# Altium project Atlas-Pi.PrjPCB
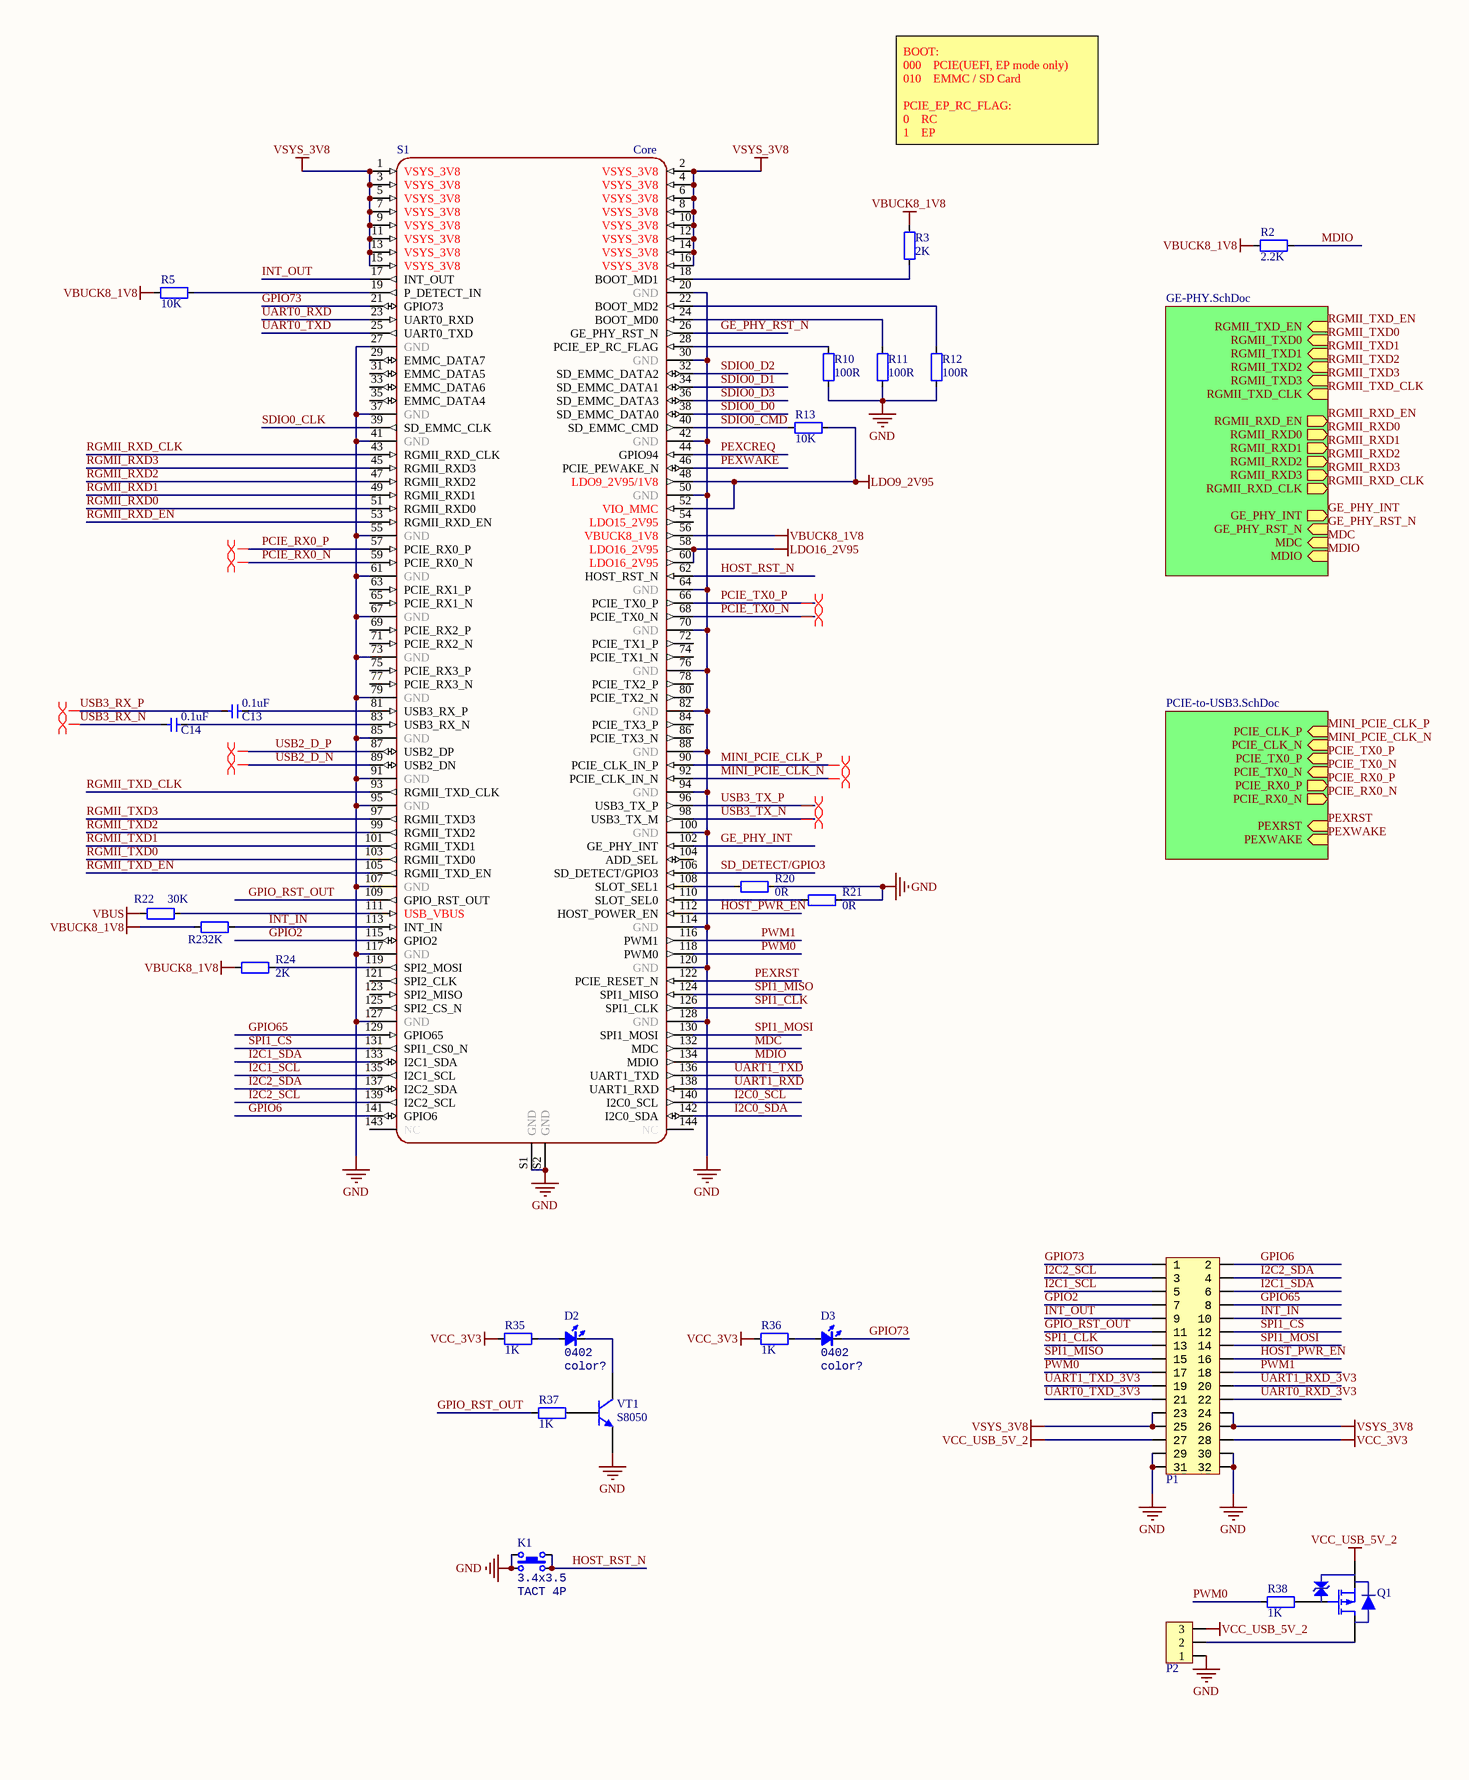
[diagram p0: Main.SchDoc, left]
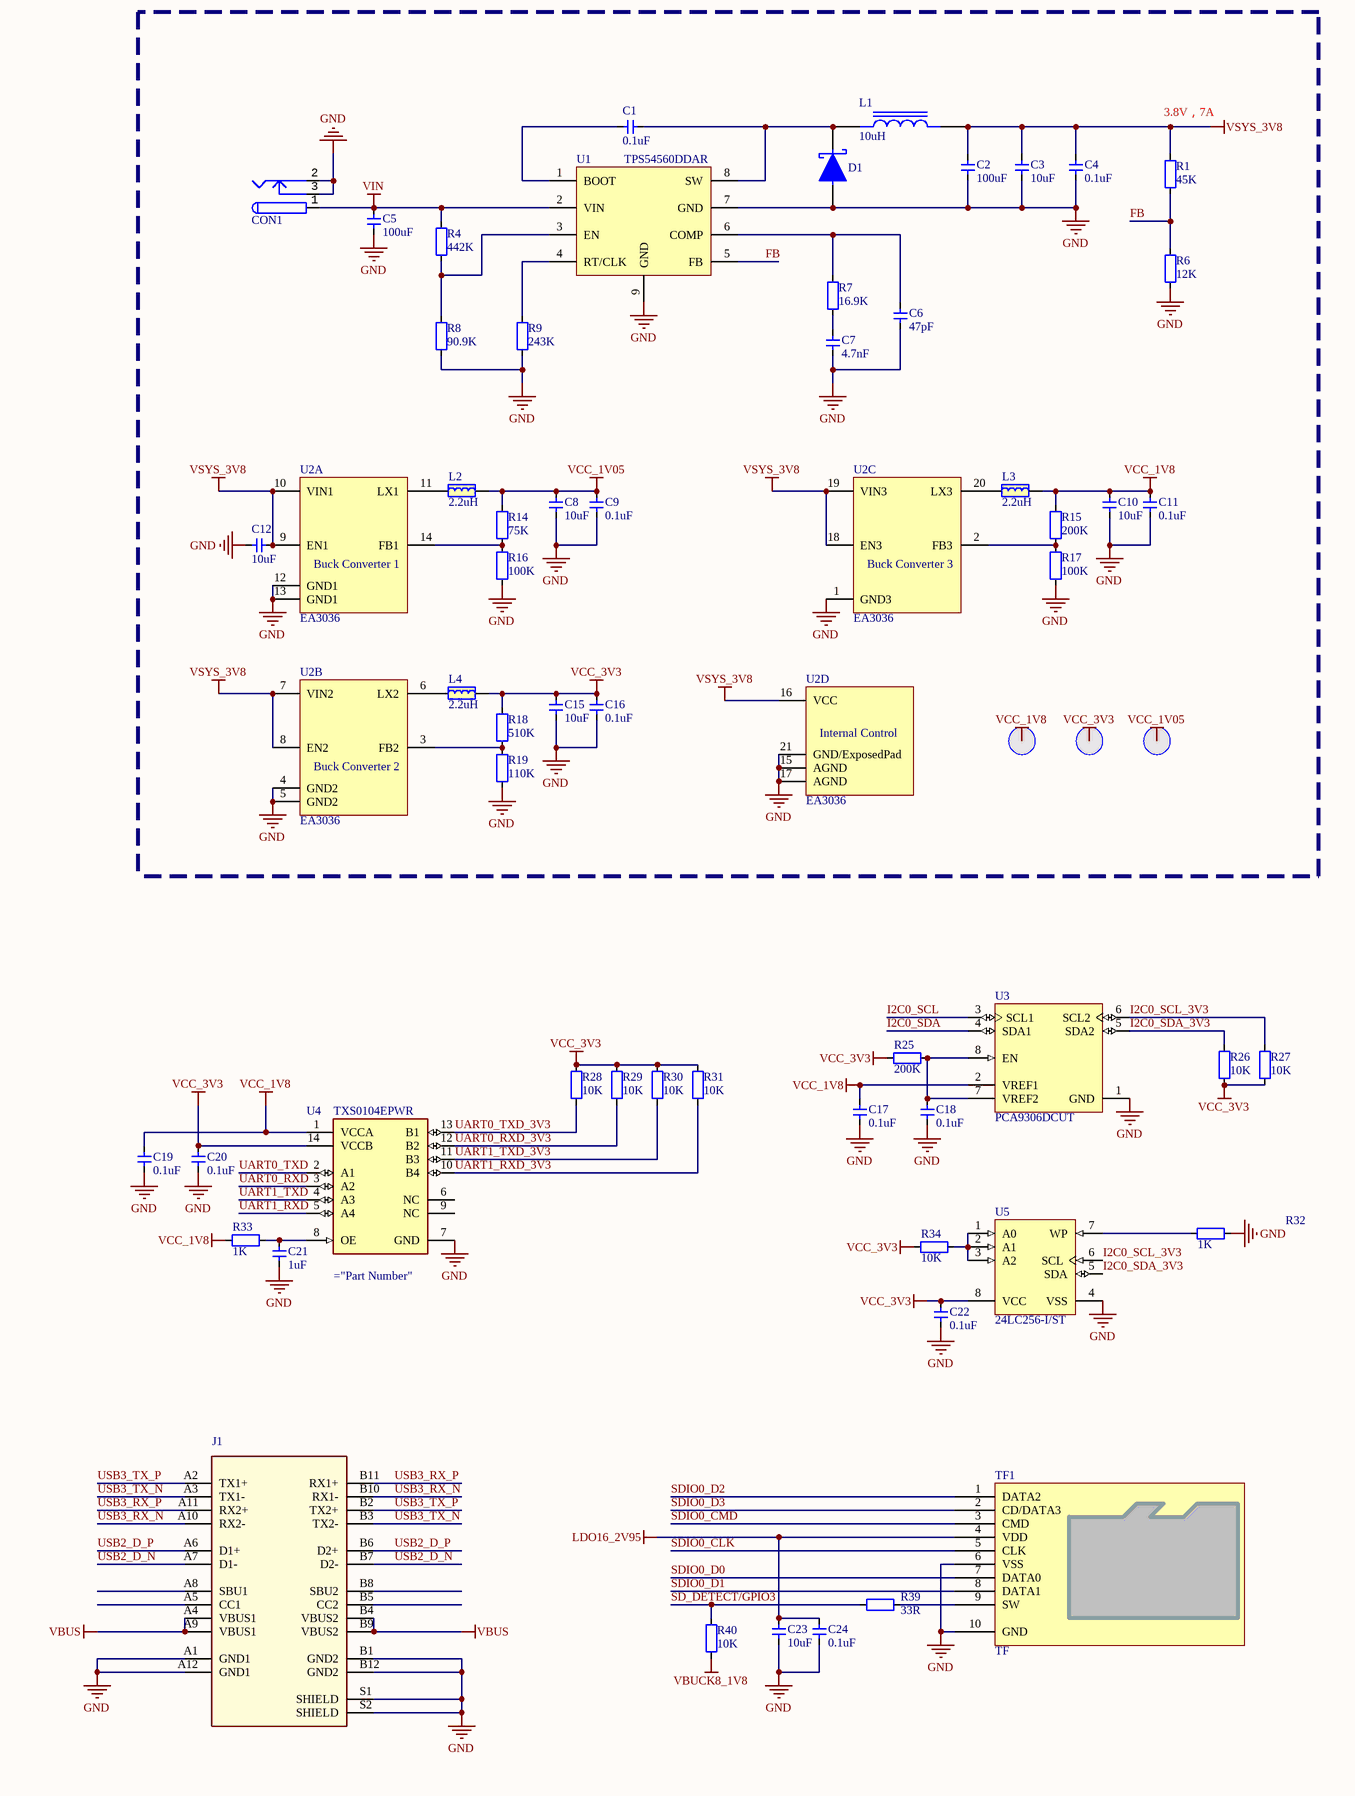
[diagram p1: Main.SchDoc, right]
3 sheets, 216 parts. Net scope: hierarchical (ports join the sheet entries above them; power ports are global).
Board file: Atlas-Pi.PcbDoc
Sheets:
  Main.SchDoc
    GE-PHY = GE-PHY.SchDoc
    PCIE-to-USB3 = PCIE-to-USB3.SchDoc

## Sheet Main.SchDoc
size A2; SheetNumber: 1; SheetTotal: 1

### Parts
C1  0.1uF  [CAP_0402]
C2  100uF  [1206-CAP]
C3  10uF  [CAP_0402]
C4  0.1uF  [CAP_0402]
C5  100uF  [1206-CAP]
C6  47pF  [CAP_0402]
C7  4.7nF  [CAP_0402]
C8  10uF  [CAP_0402]
C9  0.1uF  [CAP_0402]
C10  10uF  [CAP_0402]
C11  0.1uF  [CAP_0402]
C12  10uF  [CAP_0402]
C13  0.1uF  [CAP_0402]
C14  0.1uF  [CAP_0402]
C15  10uF  [CAP_0402]
C16  0.1uF  [CAP_0402]
C17  0.1uF  [CAP_0402]
C18  0.1uF  [CAP_0402]
C19  0.1uF  [CAP_0402]
C20  0.1uF  [CAP_0402]
C21  1uF  [CAP_0402]
C22  0.1uF  [CAP_0402]
C23  10uF  [CAP_0402]
C24  0.1uF  [CAP_0402]
CON1  PowerJack_2.5  [KLD_0202]  (value not drawn)
D1  B560C-13-F  [DO-214AB-SMC]  (value not drawn)
D2  Type: 0402  [LED_0402_ORANGE]  (hidden comment: color?)
D3  Type: 0402  [LED_0402_GREEN]  (hidden comment: color?)
J1  USB-TYPE-C-TE  [USB TYPE C TE]  (value not drawn)
K1  value 3.4x3.5  [ButtonTACT_3.5*3.55_90]  (hidden comment: TACT 4P)
L1  10uH  [IND_1040]
L2  2.2uH  [2520-L]
L3  2.2uH  [2520-L]
L4  2.2uH  [2520-L]
P1  HDR2x16_2.54  [HDR2X16_2.54_180]  (value not drawn)
P2  HDR1x3_1.25  [接插件 3P]  (value not drawn)
Q1  AO3415A  [SOT23-3]  (value not drawn)
R1  45K  [RES_0402]
R2  2.2K  [RES_0402]
R3  2K  [RES_0402]
R4  442K  [RES_0402]
R5  10K  [RES_0402]
R6  12K  [RES_0402]
R7  16.9K  [RES_0402]
R8  90.9K  [RES_0402]
R9  243K  [RES_0402]
R10  100R  [RES_0402]
R11  100R  [RES_0402]
R12  100R  [RES_0402]
R13  10K  [RES_0402]
R14  75K  [RES_0402]
R15  200K  [RES_0402]
R16  100K  [RES_0402]
R17  100K  [RES_0402]
R18  510K  [RES_0402]
R19  110K  [RES_0402]
R20  0R  [RES_0402]
R21  0R  [RES_0402]
R22  30K  [RES_0402]
R23  2K  [RES_0402]
R24  2K  [RES_0402]
R25  200K  [RES_0402]
R26  10K  [RES_0402]
R27  10K  [RES_0402]
R28  10K  [RES_0402]
R29  10K  [RES_0402]
R30  10K  [RES_0402]
R31  10K  [RES_0402]
R32  1K  [RES_0402]
R33  1K  [RES_0402]
R34  10K  [RES_0402]
R35  1K  [RES_0402]
R36  1K  [RES_0402]
R37  1K  [RES_0402]
R38  1K  [RES_0402]
R39  33R  [RES_0402]
R40  10K  [RES_0402]
S1  Core  [ATLAS-200]
T1  测试点  [TEST_PT]  (value not drawn)
T2  测试点  [TEST_PT]  (value not drawn)
T3  测试点  [TEST_PT]  (value not drawn)
TF1  TF  [TF-SOCKET]
U1  TPS54560DDAR  [SO-8-PAD]
U2  EA3036  [QFN-20]  (parts A,B,C,D of 4)
U3  PCA9306DCUT  [VSSOP-8]
U4  TXS0104EPWR  [R-PDSO-G14]
U5  24LC256-I/ST  [TSSOP-8]
VT1  S8050  [SMT_TRIODE_NPN]

### Sub-sheets
GE-PHY = GE-PHY.SchDoc: RGMII_RXD_EN (out), RGMII_RXD0 (out), RGMII_TXD3 (in), RGMII_RXD3 (out), RGMII_TXD0 (in), RGMII_RXD1 (out), RGMII_RXD2 (out), RGMII_TXD_EN (in), GE_PHY_RST_N (in), RGMII_TXD_CLK (in), RGMII_RXD_CLK (out), RGMII_TXD2 (in), RGMII_TXD1 (in), MDIO (in), MDC (in), GE_PHY_INT (out)
PCIE-to-USB3 = PCIE-to-USB3.SchDoc: PEXWAKE (in), PEXRST (in), PCIE_CLK_N (in), PCIE_RX0_N (out), PCIE_TX0_P (in), PCIE_TX0_N (in), PCIE_RX0_P (out), PCIE_CLK_P (in)

### Nets
GND: C2.1 C3.2 C4.2 C5.1 C6.1 C7.1 C8.2 C9.2 C10.2 C11.2 C12.1 C15.2 C16.2 C17.1 C18.1 C19.1 C20.1 C21.1 C22.1 C23.2 C24.2 CON1.2 CON1.3 D1.2(A) J1.A1(GND1) J1.A12(GND1) J1.B1(GND2) J1.B12(GND2) J1.S1(SHIELD) J1.S2(SHIELD) K1.1 K1.3 P1.29 P1.30 P1.31 P1.32 P2.1 R6.1 R8.1 R9.1 R10.2 R11.2 R12.2 R16.1 R17.1 R19.1 R20.1 R21.1 R32.1 S1.20(GND) S1.27(GND) S1.30(GND) S1.37(GND) S1.41(GND) S1.42(GND) S1.50(GND) S1.55(GND) S1.61(GND) S1.64(GND) S1.67(GND) S1.70(GND) S1.73(GND) S1.76(GND) S1.79(GND) S1.82(GND) S1.85(GND) S1.88(GND) S1.91(GND) S1.94(GND) S1.95(GND) S1.100(GND) S1.107(GND) S1.114(GND) S1.117(GND) S1.120(GND) S1.127(GND) S1.128(GND) S1.S1(GND) S1.S2(GND) TF1.6(VSS) TF1.10(GND) U1.7(GND) U1.9(GND) U2.1(GND3) U2.4(GND2) U2.5(GND2) U2.12(GND1) U2.13(GND1) U2.15(AGND) U2.17(AGND) U2.21(GND/ExposedPad) U3.1(GND) U4.7(GND) U5.4(VSS) VT1.2(E)
LDO9_2V95: R13.2 S1.48(LDO9_2V95/1V8) S1.52(VIO_MMC)
LDO16_2V95: C23.1 C24.1 S1.58(LDO16_2V95) S1.60(LDO16_2V95) TF1.4(VDD)
VBUCK8_1V8: R2.1 R3.1 R5.1 R23.2 R24.2 R40.1 S1.56(VBUCK8_1V8)
VBUS: J1.A4(VBUS1) J1.A9(VBUS1) J1.B4(VBUS2) J1.B9(VBUS2) R22.2
VCC_1V05: C8.1 C9.1 L2.2 R14.2 T3.0
VCC_1V8: C10.1 C11.1 C17.2 C19.2 L3.2 R15.2 R33.2 T1.0 U3.2(VREF1) U4.1(VCCA)
VCC_3V3: C15.1 C16.1 C20.2 C22.2 L4.2 P1.28 R18.2 R25.1 R26.1 R27.1 R28.1 R29.1 R30.1 R31.1 R34.2 R35.1 R36.1 T2.0 U4.14(VCCB) U5.8(VCC)
VCC_USB_5V_2: P1.27 P2.3 Q1.2(S)
VIN: C5.2 CON1.1 R4.2 U1.2(VIN)
VSYS_3V8: C2.2 C3.1 C4.1 C12.2 L1.2 P1.23 P1.24 P1.25 P1.26 R1.2 S1.1(VSYS_3V8) S1.2(VSYS_3V8) S1.3(VSYS_3V8) S1.4(VSYS_3V8) S1.5(VSYS_3V8) S1.6(VSYS_3V8) S1.7(VSYS_3V8) S1.8(VSYS_3V8) S1.9(VSYS_3V8) S1.10(VSYS_3V8) S1.11(VSYS_3V8) S1.12(VSYS_3V8) S1.13(VSYS_3V8) S1.14(VSYS_3V8) S1.15(VSYS_3V8) S1.16(VSYS_3V8) U2.7(VIN2) U2.8(EN2) U2.9(EN1) U2.10(VIN1) U2.16(VCC) U2.18(EN3) U2.19(VIN3)
FB: R1.1 R6.2 U1.5(FB)
GE_PHY_INT: S1.102(GE_PHY_INT) ; sheet GE-PHY/GE_PHY_INT
GE_PHY_RST_N: S1.26(GE_PHY_RST_N) ; sheet GE-PHY/GE_PHY_RST_N
GPIO2: P1.7 S1.115(GPIO2)
GPIO6: P1.2 S1.141(GPIO6)
GPIO65: P1.8 S1.129(GPIO65)
GPIO73: D3.2(K) P1.1 S1.21(GPIO73)
GPIO_RST_OUT: P1.11 R37.1 S1.109(GPIO_RST_OUT)
HOST_PWR_EN: P1.16 S1.112(HOST_POWER_EN)
HOST_RST_N: K1.2 K1.4 S1.62(HOST_RST_N)
I2C0_SCL: S1.140(I2C0_SCL) U3.3(SCL1)
I2C0_SCL_3V3: R27.2 U3.6(SCL2) U5.6(SCL)
I2C0_SDA: S1.142(I2C0_SDA) U3.4(SDA1)
I2C0_SDA_3V3: R26.2 U3.5(SDA2) U5.5(SDA)
I2C1_SCL: P1.5 S1.135(I2C1_SCL)
I2C1_SDA: P1.6 S1.133(I2C1_SDA)
I2C2_SCL: P1.3 S1.139(I2C2_SCL)
I2C2_SDA: P1.4 S1.137(I2C2_SDA)
INT_IN: P1.10 R23.1 S1.113(INT_IN)
INT_OUT: P1.9 S1.17(INT_OUT)
MDC: S1.132(MDC) ; sheet GE-PHY/MDC
MDIO: R2.2 S1.134(MDIO) ; sheet GE-PHY/MDIO
MINI_PCIE_CLK_N: S1.92(PCIE_CLK_IN_N) ; sheet PCIE-to-USB3/PCIE_CLK_N
MINI_PCIE_CLK_P: S1.90(PCIE_CLK_IN_P) ; sheet PCIE-to-USB3/PCIE_CLK_P
PCIE_RX0_N: S1.59(PCIE_RX0_N) ; sheet PCIE-to-USB3/PCIE_RX0_N
PCIE_RX0_P: S1.57(PCIE_RX0_P) ; sheet PCIE-to-USB3/PCIE_RX0_P
PCIE_TX0_N: S1.68(PCIE_TX0_N) ; sheet PCIE-to-USB3/PCIE_TX0_N
PCIE_TX0_P: S1.66(PCIE_TX0_P) ; sheet PCIE-to-USB3/PCIE_TX0_P
PEXCREQ: S1.44(GPIO94)
PEXRST: S1.122(PCIE_RESET_N) ; sheet PCIE-to-USB3/PEXRST
PEXWAKE: S1.46(PCIE_PEWAKE_N) ; sheet PCIE-to-USB3/PEXWAKE
PWM0: P1.17 R38.1 S1.118(PWM0)
PWM1: P1.18 S1.116(PWM1)
RGMII_RXD0: S1.51(RGMII_RXD0) ; sheet GE-PHY/RGMII_RXD0
RGMII_RXD1: S1.49(RGMII_RXD1) ; sheet GE-PHY/RGMII_RXD1
RGMII_RXD2: S1.47(RGMII_RXD2) ; sheet GE-PHY/RGMII_RXD2
RGMII_RXD3: S1.45(RGMII_RXD3) ; sheet GE-PHY/RGMII_RXD3
RGMII_RXD_CLK: S1.43(RGMII_RXD_CLK) ; sheet GE-PHY/RGMII_RXD_CLK
RGMII_RXD_EN: S1.53(RGMII_RXD_EN) ; sheet GE-PHY/RGMII_RXD_EN
RGMII_TXD0: S1.103(RGMII_TXD0) ; sheet GE-PHY/RGMII_TXD0
RGMII_TXD1: S1.101(RGMII_TXD1) ; sheet GE-PHY/RGMII_TXD1
RGMII_TXD2: S1.99(RGMII_TXD2) ; sheet GE-PHY/RGMII_TXD2
RGMII_TXD3: S1.97(RGMII_TXD3) ; sheet GE-PHY/RGMII_TXD3
RGMII_TXD_CLK: S1.93(RGMII_TXD_CLK) ; sheet GE-PHY/RGMII_TXD_CLK
RGMII_TXD_EN: S1.105(RGMII_TXD_EN) ; sheet GE-PHY/RGMII_TXD_EN
SD_DETECT/GPIO3: R39.2 R40.2 S1.106(SD_DETECT/GPIO3)
SDIO0_CLK: S1.39(SD_EMMC_CLK) TF1.5(CLK)
SDIO0_CMD: R13.1 S1.40(SD_EMMC_CMD) TF1.3(CMD)
SDIO0_D0: S1.38(SD_EMMC_DATA0) TF1.7(DATA0)
SDIO0_D1: S1.34(SD_EMMC_DATA1) TF1.8(DATA1)
SDIO0_D2: S1.32(SD_EMMC_DATA2) TF1.1(DATA2)
SDIO0_D3: S1.36(SD_EMMC_DATA3) TF1.2(CD/DATA3)
SPI1_CLK: P1.13 S1.126(SPI1_CLK)
SPI1_CS: P1.12 S1.131(SPI1_CS0_N)
SPI1_MISO: P1.15 S1.124(SPI1_MISO)
SPI1_MOSI: P1.14 S1.130(SPI1_MOSI)
UART0_RXD: S1.23(UART0_RXD) U4.3(A2)
UART0_RXD_3V3: P1.22 R29.2 U4.12(B2)
UART0_TXD: S1.25(UART0_TXD) U4.2(A1)
UART0_TXD_3V3: P1.21 R28.2 U4.13(B1)
UART1_RXD: S1.138(UART1_RXD) U4.5(A4)
UART1_RXD_3V3: P1.20 R31.2 U4.10(B4)
UART1_TXD: S1.136(UART1_TXD) U4.4(A3)
UART1_TXD_3V3: P1.19 R30.2 U4.11(B3)
USB2_D_N: J1.A7(D1-) J1.B7(D2-) S1.89(USB2_DN)
USB2_D_P: J1.A6(D1+) J1.B6(D2+) S1.87(USB2_DP)
USB3_RX_N: C14.2 J1.A10(RX2-) J1.B10(RX1-)
USB3_RX_P: C13.2 J1.A11(RX2+) J1.B11(RX1+)
USB3_TX_N: J1.A3(TX1-) J1.B3(TX2-) S1.98(USB3_TX_M)
USB3_TX_P: J1.A2(TX1+) J1.B2(TX2+) S1.96(USB3_TX_P)
NetC1_1: C1.1 D1.1(C) L1.1 U1.8(SW)
NetC1_2: C1.2 U1.1(BOOT)
NetC6_2: C6.2 R7.2 U1.6(COMP)
NetC7_2: C7.2 R7.1
NetC13_1: C13.1 S1.81(USB3_RX_P)
NetC14_1: C14.1 S1.83(USB3_RX_N)
NetC18_2: C18.2 R25.2 U3.7(VREF2) U3.8(EN)
NetC21_2: C21.2 R33.1 U4.8(OE)
NetD2_1: D2.1(A) R35.2
NetD2_2: D2.2(K) VT1.3(C)
NetD3_1: D3.1(A) R36.2
NetL2_1: L2.1 U2.11(LX1)
NetL3_1: L3.1 U2.20(LX3)
NetL4_1: L4.1 U2.6(LX2)
NetP2_2: P2.2 Q1.3(D)
NetQ1_1: Q1.1(G) R38.2
NetR3_2: R3.2 S1.18(BOOT_MD1)
NetR4_1: R4.1 R8.2 U1.3(EN)
NetR5_2: R5.2 S1.19(P_DETECT_IN)
NetR9_2: R9.2 U1.4(RT/CLK)
NetR10_1: R10.1 S1.28(PCIE_EP_RC_FLAG)
NetR11_1: R11.1 S1.24(BOOT_MD0)
NetR12_1: R12.1 S1.22(BOOT_MD2)
NetR14_1: R14.1 R16.2 U2.14(FB1)
NetR15_1: R15.1 R17.2 U2.2(FB3)
NetR18_1: R18.1 R19.2 U2.3(FB2)
NetR20_2: R20.2 S1.108(SLOT_SEL1)
NetR21_2: R21.2 S1.110(SLOT_SEL0)
NetR22_1: R22.1 S1.111(USB_VBUS)
NetR24_1: R24.1 S1.119(SPI2_MOSI)
NetR32_2: R32.2 U5.7(WP)
NetR34_1: R34.1 U5.1(A0) U5.2(A1) U5.3(A2)
NetR37_2: R37.2 VT1.1(B)
NetR39_1: R39.1 TF1.9(SW)

Not connected (* = marked no-connect by the designer): J1 A5(CC1) A8(SBU1) B5(CC2) B8(SBU2); S1 29(EMMC_DATA7) 31(EMMC_DATA5) 33(EMMC_DATA6) 35(EMMC_DATA4) 54(LDO15_2V95) 63(PCIE_RX1_P) 65(PCIE_RX1_N) 69(PCIE_RX2_P) 71(PCIE_RX2_N) 72(PCIE_TX1_P) 74(PCIE_TX1_N) 75(PCIE_RX3_P) 77(PCIE_RX3_N) 78(PCIE_TX2_P) 80(PCIE_TX2_N) 84(PCIE_TX3_P) 86(PCIE_TX3_N) 104(ADD_SEL) 121(SPI2_CLK) 123(SPI2_MISO) 125(SPI2_CS_N) 143(NC) 144(NC); U4 6(NC) 9(NC)

### Layout directives
differential pair: MINI_PCIE_CLK_N, MINI_PCIE_CLK_P, PCIE_RX0_N, PCIE_RX0_P, PCIE_TX0_N, PCIE_TX0_P, USB2_D_N, USB2_D_P, USB3_RX_N, USB3_RX_P, USB3_TX_N, USB3_TX_P

### Notes on the sheet
- BOOT:
  000    PCIE(UEFI, EP mode only)
  010    EMMC / SD Card
  PCIE_EP_RC_FLAG:
  0    RC
  1    EP
- (near R1) 3.8V，7A
- (in symbol EA3036, part A) Buck Converter 1
- (in symbol EA3036, part B) Buck Converter 2
- (in symbol EA3036, part C) Buck Converter 3
- (in symbol EA3036, part D) Internal Control

### Library data of the parts
C1 C3 C4 C6-C24 = 电容-0402: Capacitor; Value: 0.1u
C2 C5 = 电容-1206: Capacitor; Value: 0.1u
CON1 = PowerJack_2.5: DC Power Jack
D2 D3 = LED_0402: LED; Value: color?
J1 = USB-TYPE-C-TE: SPLASH PROOF USB TYPE C REC, DUAL SMT; MP: 2295018-2; Number_of_Positions: 24; MF: TE Connectivity; Product_Type: Connector; Centerline_Pitch: .5 mm[.019 in]; EU_RoHS_Compliance: Compliant; Availability: Good; Package: None; Link: http://www.te.com/usa-en/product-2295018-2.html; Price: 1.84 USD; SnapEDA_Link: https://www.snapeda.com/parts/2295018-2/TE%20Connectivity%20AMP%20Connectors/view-part/?ref=snap; Value: *
K1 = ButtonTACT: Button; type: TACT 4P
L1 = 电感-1040: Fixed Inductors 4.7uH 30% SMD 1240; MF: Bourns; MP: SRR1240-4R7Y; Price: None; SnapEDA_Link: https://www.snapeda.com/parts/SRR1240-4R7Y/Bourns/view-part/1646614/?ref=snap; Check_prices: https://www.snapeda.com/parts/SRR1240-4R7Y/Bourns/view-part/1646614/?ref=eda; Availability: Bad; Package: None; Value: *
L2-L4 = 电感-2520: 磁珠
P1 = HDR2x16_2.54: Header
P2 = HDR1x3_1.25: Header
Q1 = AO3415A: MOSFET; Published: 8-Jun-2000; LatestRevisionDate: 17-Jul-2002; LatestRevisionNote: Re-released for DXP Platform.; PackageVersion: 1995/1996; PackageReference: E3; Publisher: Altium Limited; PackageDescription: TO, Flat Index; 3 In-Line, Axial Leads; Body Dia. 4.6mm; Lead Dia. 0.5 mm (max)
R1-R40 = 电阻-0402: Resistor; Value: 22R
S1 = Atlas-200: Atlas-A200 AI-SOM
TF1 = TF卡座: 8脚自弹
U1 = TPS54560DDAR: DC-DC Convter
U2 = EA3036: EA3036 is a 3CH power management IC for applications powered by one Li-Ion battery or a DC 5V adapter.
U3 = PCA9306DCUT: Dual Bi-Directional I2C-Bus and SMBus Voltage Level-Translator, 0 to 5.5 V, -40 to 85 degC, 8-pin US8 (DCU), Green (RoHS & no Sb/Br); Manufacturer: Texas Instruments; SubFamily: I2C Special Function; Function: Voltage Translator; fSCLK(Max)(MHz): 400; Open Drain I/O Type: Yes; No. of Outputs: 2; Vcc range(V): 0 to 5.5; Rating: Catalog; tpd max(ns): 1.5; Eco-Plan: Green (RoHS & no Sb/Br); PartNumber: PCA9306DCUT; ComponentLink1Description: Datasheet; ComponentLink2Description: Package Specification; DatasheetVersion: SCPS113J; ComponentLink1URL: http://www.ti.com/general/docs/lit/getliterature.tsp?genericPartNumber=PCA9306&fileType=pdf; Code_JEDEC: MO-187-CA; ComponentLink2URL: http://www.ti.com/litv/pdf/mpds050d; Enable Pin: Yes; PackageReference: DCU8; 5V Tolerant I/O: Yes; On-Chip Power-on-Reset: No; PackageVersion: revF, Jul-2005; PackageDescription: 8-Pin Thin Shrink Small Outline Package 0.5 mm Pitch; Mounting Technology: Surface Mount; Max Frequency(kHz): 400
U5 = 24LC256-I/ST: 256Kbit, 400kHz, 2.5V, I2C Serial EEPROM, 8-Pin TSSOP, Industrial Temperature; Code_JEDEC: MO-153; PackageVersion: revBB, Aug-2009; PackageReference: TSSOP-ST8; PackageDescription: 8-Lead Plastic Thin Shrink Small Outline (ST) - 4.4mm Body [TSSOP]; DatasheetVersion: revP, Oct-2007; PartNumber: 24LC256-I/ST
VT1 = SMT_TRIODE_NPN: Surface mount NPN transistor, package SOT-23

## Sheet GE-PHY.SchDoc
size A4
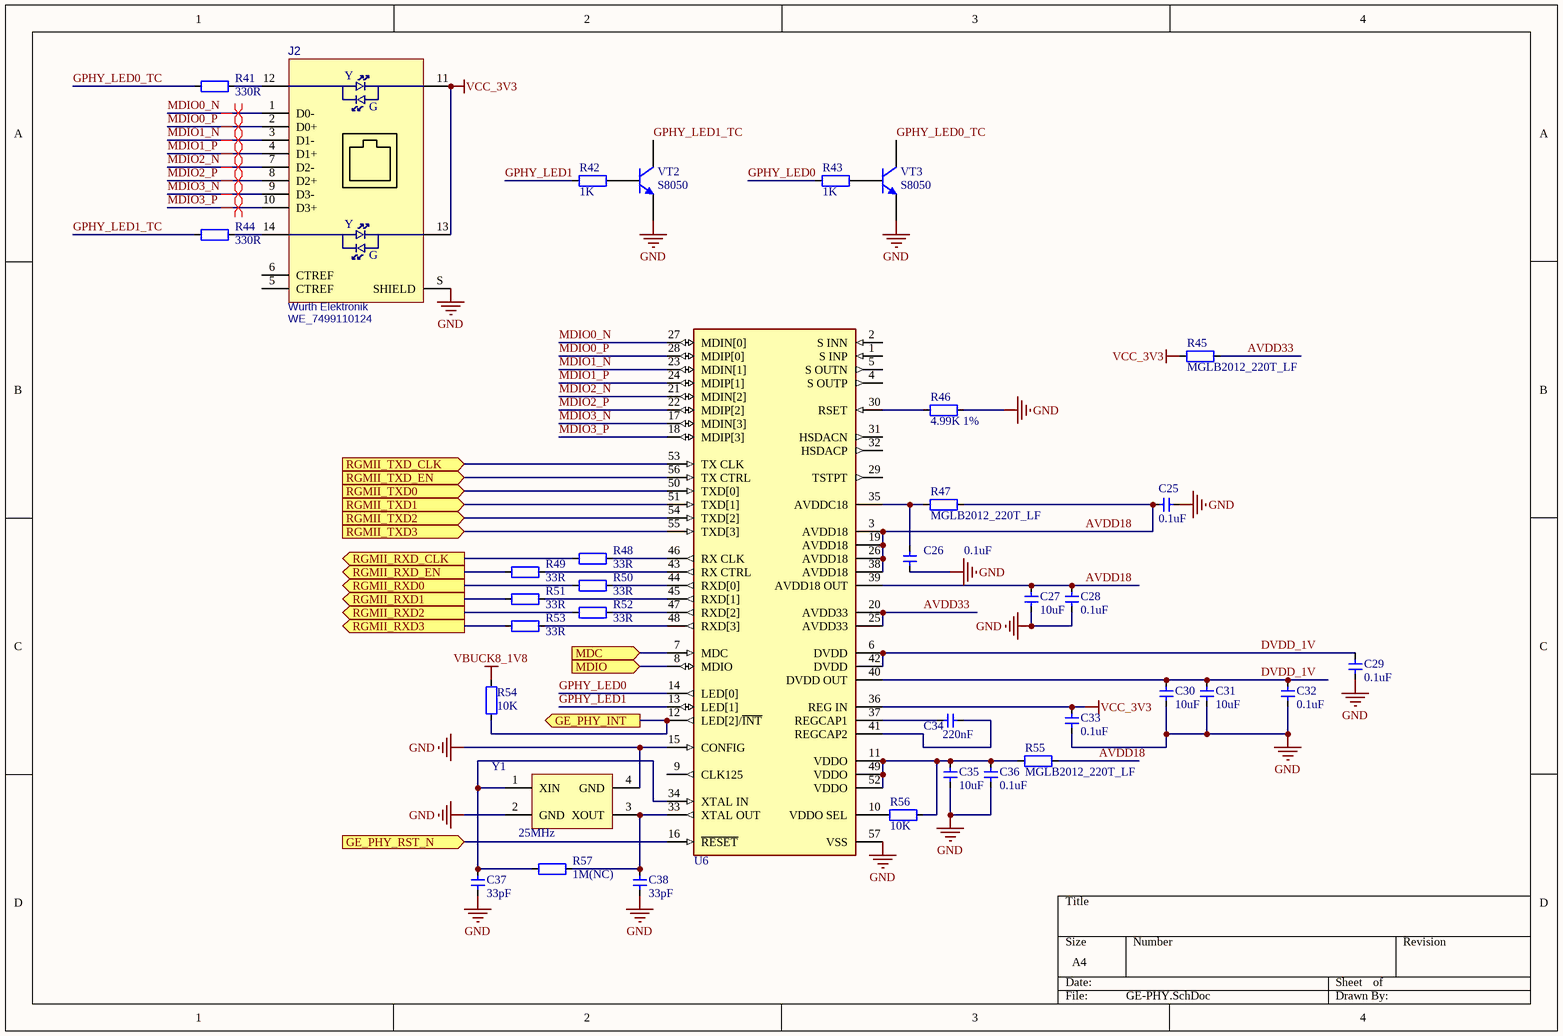
[diagram p2: GE-PHY.SchDoc]

### Parts
C25  0.1uF  [CAP_0402]
C26  0.1uF  [CAP_0402]
C27  10uF  [CAP_0402]
C28  0.1uF  [CAP_0402]
C29  0.1uF  [CAP_0402]
C30  10uF  [CAP_0402]
C31  10uF  [CAP_0402]
C32  0.1uF  [CAP_0402]
C33  0.1uF  [CAP_0402]
C34  220nF  [CAP_0402]
C35  10uF  [CAP_0402]
C36  0.1uF  [CAP_0402]
C37  33pF  [CAP_0402]
C38  33pF  [CAP_0402]
J2  Manufacturer: Wurth Elektronik  [GE-SOCKET]  (hidden comment: WE_7499110124)
R41  330R  [RES_0402]
R42  1K  [RES_0402]
R43  1K  [RES_0402]
R44  330R  [RES_0402]
R45  MGLB2012_220T_LF  [0805-L]
R46  4.99K 1%  [RES_0402]
R47  MGLB2012_220T_LF  [0805-L]
R48  33R  [RES_0402]
R49  33R  [RES_0402]
R50  33R  [RES_0402]
R51  33R  [RES_0402]
R52  33R  [RES_0402]
R53  33R  [RES_0402]
R54  10K  [RES_0402]
R55  MGLB2012_220T_LF  [0805-L]
R56  10K  [RES_0402]
R57  1M(NC)  [RES_0402]
U6  88E1512-A0-NNP2I000  [QFN-56]  (value not drawn)
VT2  S8050  [SMT_TRIODE_NPN]
VT3  S8050  [SMT_TRIODE_NPN]
Y1  25MHz  [晶振2520]

### Ports
GE_PHY_INT (out), GE_PHY_RST_N (in), MDC (in), MDIO (in), RGMII_RXD0 (out), RGMII_RXD1 (out), RGMII_RXD2 (out), RGMII_RXD3 (out), RGMII_RXD_CLK (out), RGMII_RXD_EN (out), RGMII_TXD0 (in), RGMII_TXD1 (in), RGMII_TXD2 (in), RGMII_TXD3 (in), RGMII_TXD_CLK (in), RGMII_TXD_EN (in)

### Nets
GND: C25.2 C26.1 C27.2 C28.2 C29.2 C30.2 C31.2 C32.2 C33.2 C35.2 C36.2 C37.2 C38.2 J2.S(SHIELD) R46.2 U6.15(CONFIG) U6.57(VSS) VT2.2(E) VT3.2(E) Y1.2(GND) Y1.4(GND)
VBUCK8_1V8: R54.1
VCC_3V3: C33.1 J2.11 J2.13 R45.1 U6.36(REG_IN)
AVDD18: C25.1 C27.1 C28.1 R47.2 R55.2 U6.3(AVDD18) U6.19(AVDD18) U6.26(AVDD18) U6.38(AVDD18) U6.39(AVDD18_OUT)
AVDD33: R45.2 U6.20(AVDD33) U6.25(AVDD33)
DVDD_1V: C29.1 C30.1 C31.1 C32.1 U6.6(DVDD) U6.40(DVDD_OUT) U6.42(DVDD)
GE_PHY_INT: R54.2 U6.12(LED[2]/~{INT}) ; port GE_PHY_INT
GE_PHY_RST_N: U6.16(~{RESET}) ; port GE_PHY_RST_N
GPHY_LED0: R43.1 U6.14(LED[0])
GPHY_LED0_TC: R41.2 VT3.3(C)
GPHY_LED1: R42.1 U6.13(LED[1])
GPHY_LED1_TC: R44.2 VT2.3(C)
MDC: U6.7(MDC) ; port MDC
MDIO: U6.8(MDIO) ; port MDIO
MDIO0_N: J2.1(D0-) U6.27(MDIN[0])
MDIO0_P: J2.2(D0+) U6.28(MDIP[0])
MDIO1_N: J2.3(D1-) U6.23(MDIN[1])
MDIO1_P: J2.4(D1+) U6.24(MDIP[1])
MDIO2_N: J2.7(D2-) U6.21(MDIN[2])
MDIO2_P: J2.8(D2+) U6.22(MDIP[2])
MDIO3_N: J2.9(D3-) U6.17(MDIN[3])
MDIO3_P: J2.10(D3+) U6.18(MDIP[3])
RGMII_RXD0: R50.2 ; port RGMII_RXD0
RGMII_RXD1: R51.2 ; port RGMII_RXD1
RGMII_RXD2: R52.2 ; port RGMII_RXD2
RGMII_RXD3: R53.2 ; port RGMII_RXD3
RGMII_RXD_CLK: R48.2 ; port RGMII_RXD_CLK
RGMII_RXD_EN: R49.2 ; port RGMII_RXD_EN
RGMII_TXD0: U6.50(TXD[0]) ; port RGMII_TXD0
RGMII_TXD1: U6.51(TXD[1]) ; port RGMII_TXD1
RGMII_TXD2: U6.54(TXD[2]) ; port RGMII_TXD2
RGMII_TXD3: U6.55(TXD[3]) ; port RGMII_TXD3
RGMII_TXD_CLK: U6.53(TX_CLK) ; port RGMII_TXD_CLK
RGMII_TXD_EN: U6.56(TX_CTRL) ; port RGMII_TXD_EN
NetC26_2: C26.2 R47.1 U6.35(AVDDC18)
NetC34_1: C34.1 U6.37(REGCAP1)
NetC34_2: C34.2 U6.41(REGCAP2)
NetC35_1: C35.1 C36.1 R55.1 R56.2 U6.11(VDDO) U6.49(VDDO) U6.52(VDDO)
NetC37_1: C37.1 R57.2 U6.34(XTAL_IN) Y1.1(XIN)
NetC38_1: C38.1 R57.1 U6.33(XTAL_OUT) Y1.3(XOUT)
NetJ2_12: J2.12 R41.1
NetJ2_14: J2.14 R44.1
NetR42_2: R42.2 VT2.1(B)
NetR43_2: R43.2 VT3.1(B)
NetR46_1: R46.1 U6.30(RSET)
NetR48_1: R48.1 U6.46(RX_CLK)
NetR49_1: R49.1 U6.43(RX_CTRL)
NetR50_1: R50.1 U6.44(RXD[0])
NetR51_1: R51.1 U6.45(RXD[1])
NetR52_1: R52.1 U6.47(RXD[2])
NetR53_1: R53.1 U6.48(RXD[3])
NetR56_1: R56.1 U6.10(VDDO_SEL)

Not connected (* = marked no-connect by the designer): J2 5(CTREF) 6(CTREF); U6 1(S_INP) 2(S_INN) 4(S_OUTP) 5(S_OUTN) 9(CLK125) 29(TSTPT) 31(HSDACN) 32(HSDACP)

### Layout directives
differential pair: MDIO0_N, MDIO0_P, MDIO1_N, MDIO1_P, MDIO2_N, MDIO2_P, MDIO3_N, MDIO3_P

### Notes on the sheet
- (in symbol GE-SOCKET) Y; G

### Library data of the parts
C25-C38 = 电容-0402: Capacitor; Value: 0.1u
J2 = GE-SOCKET: LAN-Transformer WE-RJ45LAN 10/100/1000 BaseT; PartNumber: WE_7499110124; Value: WE_7499110124; PartSymbol: WE_7499110124
R41-R44 R46 R48-R54 R56 R57 = 电阻-0402: Resistor; Value: 22R
R45 R47 R55 = 电阻-0805: Resistor; Value: 22R
VT2 VT3 = SMT_TRIODE_NPN: as VT1 on sheet Main
Y1 = 晶振-4Pin-无源: 2520无源; MF: ECS International; MP: ECS-3225S30-240-EN-TR; Package: SMD-6 ECS International; Price: 0.75 USD; Availability: Unavailable; Value: *

## Sheet PCIE-to-USB3.SchDoc
size A3
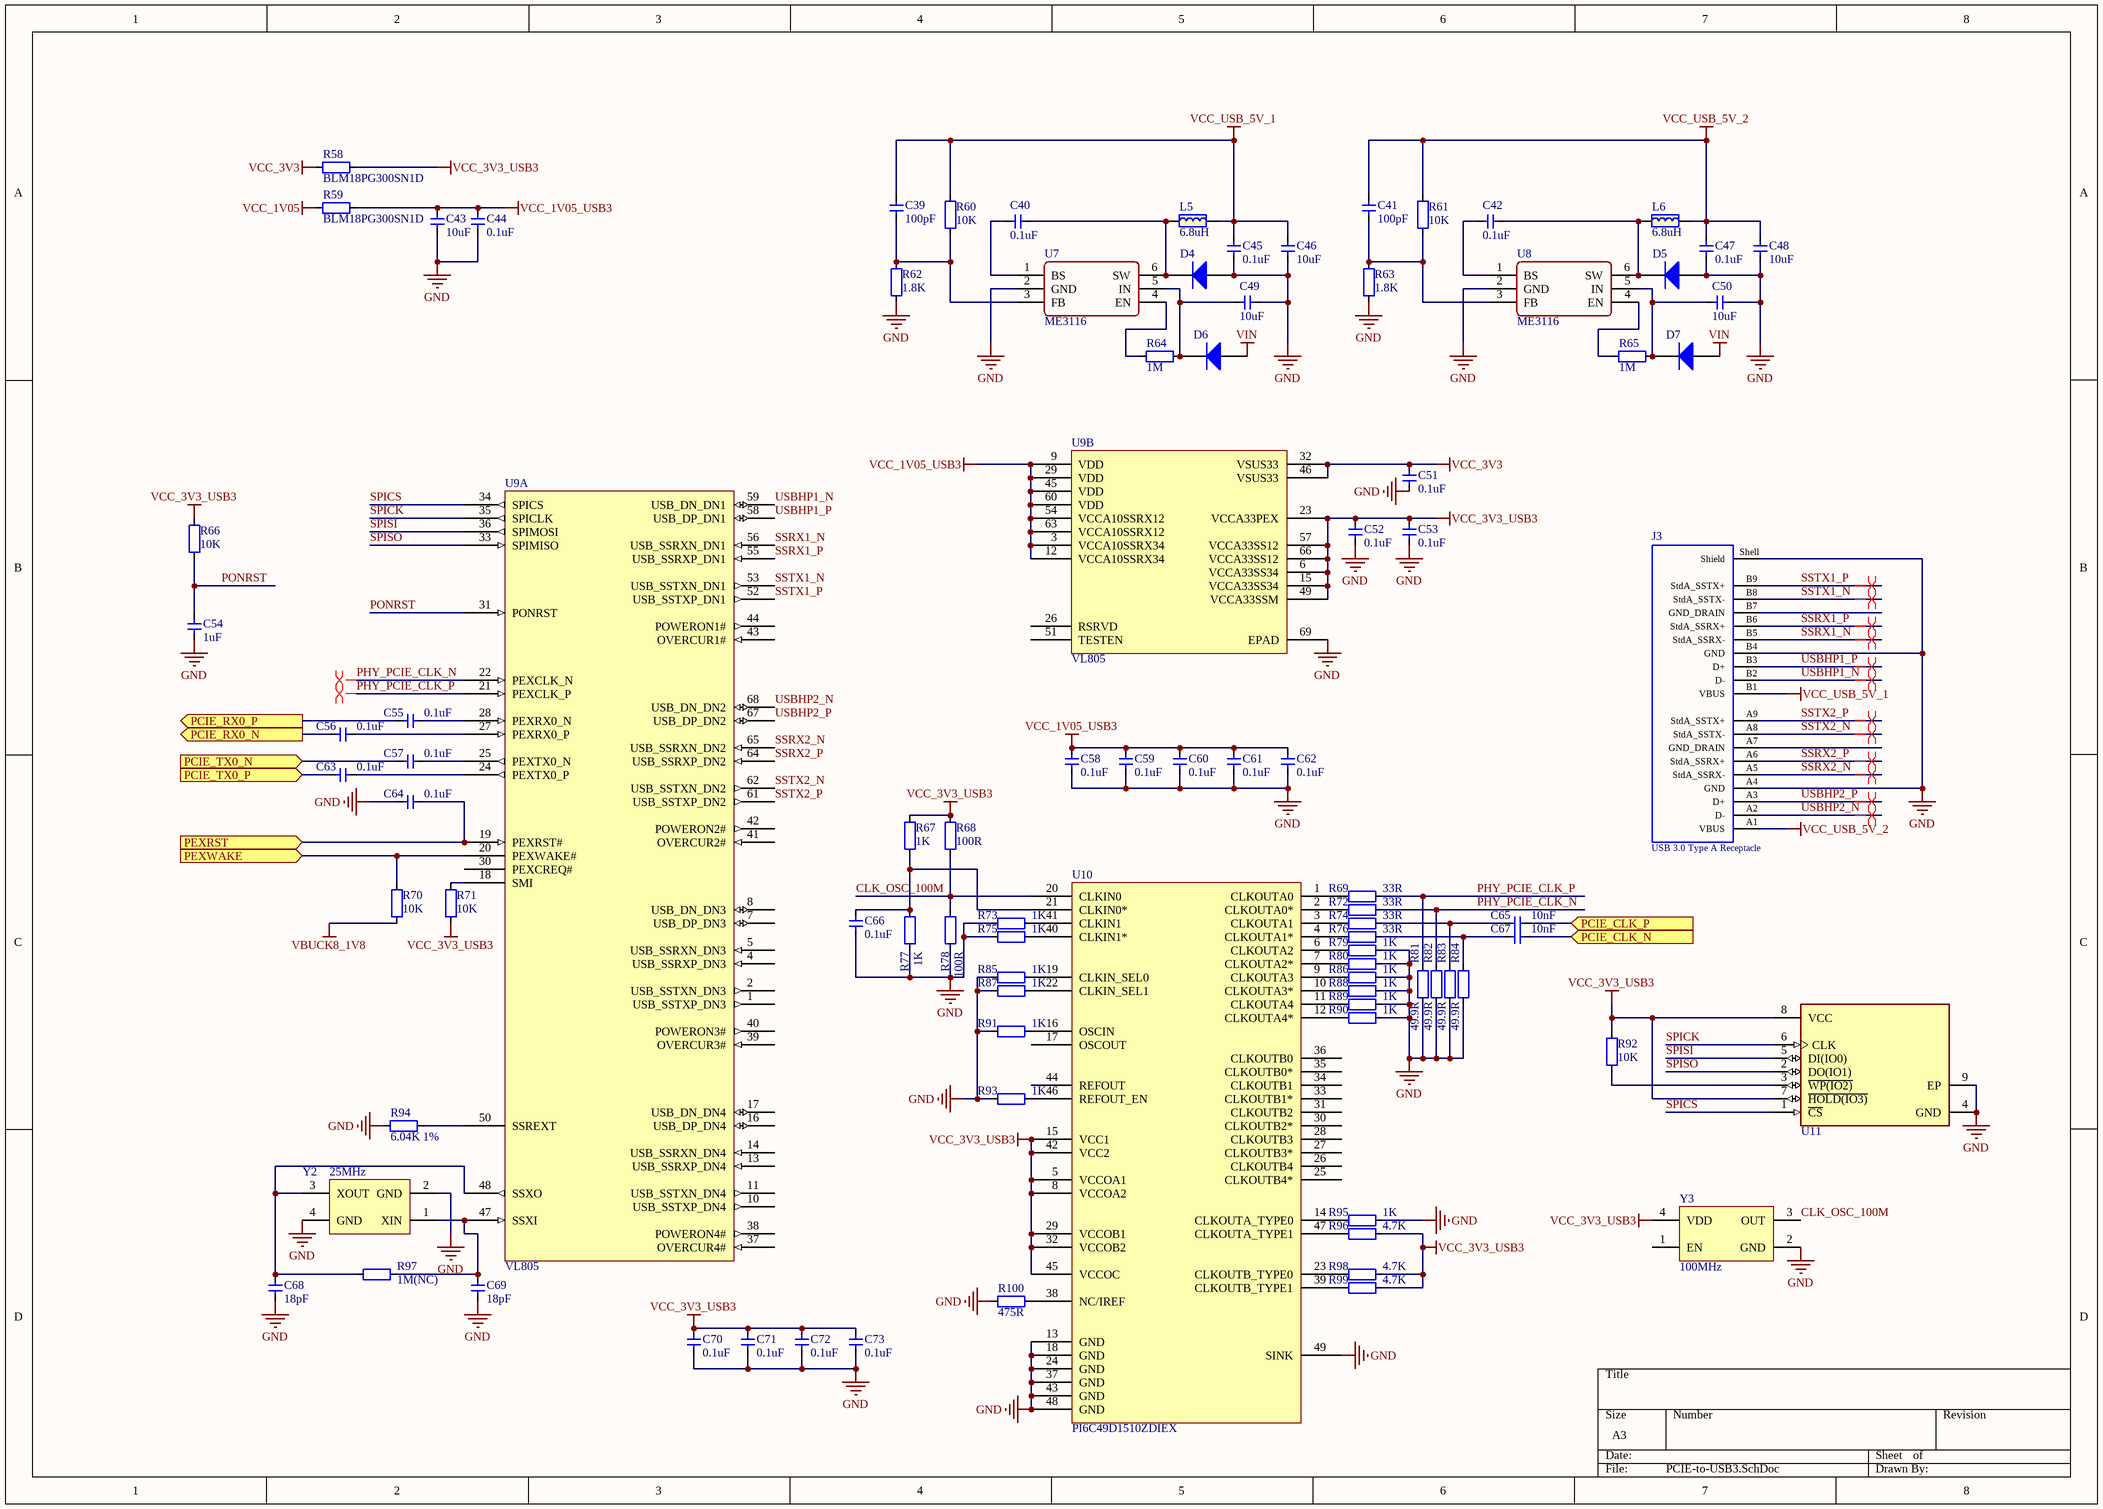
[diagram p3: PCIE-to-USB3.SchDoc]

### Parts
C39  100pF  [CAP_0402]
C40  0.1uF  [CAP_0402]
C41  100pF  [CAP_0402]
C42  0.1uF  [CAP_0402]
C43  10uF  [CAP_0402]
C44  0.1uF  [CAP_0402]
C45  0.1uF  [CAP_0402]
C46  10uF  [CAP_0402]
C47  0.1uF  [CAP_0402]
C48  10uF  [CAP_0402]
C49  10uF  [CAP_0402]
C50  10uF  [CAP_0402]
C51  0.1uF  [CAP_0402]
C52  0.1uF  [CAP_0402]
C53  0.1uF  [CAP_0402]
C54  1uF  [CAP_0402]
C55  0.1uF  [CAP_0402]
C56  0.1uF  [CAP_0402]
C57  0.1uF  [CAP_0402]
C58  0.1uF  [CAP_0402]
C59  0.1uF  [CAP_0402]
C60  0.1uF  [CAP_0402]
C61  0.1uF  [CAP_0402]
C62  0.1uF  [CAP_0402]
C63  0.1uF  [CAP_0402]
C64  0.1uF  [CAP_0402]
C65  10nF  [CAP_0402]
C66  0.1uF  [CAP_0402]
C67  10nF  [CAP_0402]
C68  18pF  [CAP_0402]
C69  18pF  [CAP_0402]
C70  0.1uF  [CAP_0402]
C71  0.1uF  [CAP_0402]
C72  0.1uF  [CAP_0402]
C73  0.1uF  [CAP_0402]
D4  二极管-5B5817WS  [SOD-323]  (value not drawn)
D5  二极管-5B5817WS  [SOD-323]  (value not drawn)
D6  二极管-5B5817WS  [SOD-323]  (value not drawn)
D7  二极管-5B5817WS  [SOD-323]  (value not drawn)
J3  USB 3.0 Type A Receptacle  [692141030100]
L5  6.8uH  [IND-201612]
L6  6.8uH  [IND-201612]
R58  BLM18PG300SN1D  [0603-RES]
R59  BLM18PG300SN1D  [0603-RES]
R60  10K  [RES_0402]
R61  10K  [RES_0402]
R62  1.8K  [RES_0402]
R63  1.8K  [RES_0402]
R64  1M  [RES_0402]
R65  1M  [RES_0402]
R66  10K  [RES_0402]
R67  1K  [RES_0402]
R68  100R  [RES_0402]
R69  33R  [RES_0402]
R70  10K  [RES_0402]
R71  10K  [RES_0402]
R72  33R  [RES_0402]
R73  1K  [RES_0402]
R74  33R  [RES_0402]
R75  1K  [RES_0402]
R76  33R  [RES_0402]
R77  1K  [RES_0402]
R78  100R  [RES_0402]
R79  1K  [RES_0402]
R80  1K  [RES_0402]
R81  49.9R  [RES_0402]
R82  49.9R  [RES_0402]
R83  49.9R  [RES_0402]
R84  49.9R  [RES_0402]
R85  1K  [RES_0402]
R86  1K  [RES_0402]
R87  1K  [RES_0402]
R88  1K  [RES_0402]
R89  1K  [RES_0402]
R90  1K  [RES_0402]
R91  1K  [RES_0402]
R92  10K  [RES_0402]
R93  1K  [RES_0402]
R94  6.04K 1%  [RES_0402]
R95  1K  [RES_0402]
R96  4.7K  [RES_0402]
R97  1M(NC)  [RES_0402]
R98  4.7K  [RES_0402]
R99  4.7K  [RES_0402]
R100  475R  [RES_0402]
U7  ME3116  [SOT23-6]
U8  ME3116  [SOT23-6]
U9  VL805  [QFN-68-0.4MM]  (parts A,B of 2)
U10  PI6C49D1510ZDIEX  [QFN-48_7X7]
U11  W25Q80DVUXIE_TR  [SPI-FLASH-USON]  (value not drawn)
Y2  25MHz  [晶振2520]
Y3  100MHz  [晶振2520]

### Ports
PCIE_CLK_N (in), PCIE_CLK_P (in), PCIE_RX0_N (out), PCIE_RX0_P (out), PCIE_TX0_N (in), PCIE_TX0_P (in), PEXRST (in), PEXWAKE (in)

### Nets
GND: C43.2 C44.2 C45.1 C46.1 C47.1 C48.1 C49.1 C50.1 C51.1 C52.1 C53.1 C54.2 C58.1 C59.1 C60.1 C61.1 C62.1 C64.1 C66.1 C68.1 C69.1 C70.1 C71.1 C72.1 C73.1 D4.1(A) D5.1(A) J3.A4(GND) J3.B4(GND) J3.Shell(Shield) R62.1 R63.1 R73.2 R75.2 R77.1 R78.1 R79.1 R80.1 R81.2 R82.2 R83.2 R84.2 R85.2 R86.1 R87.2 R88.1 R89.1 R90.1 R91.2 R93.2 R94.1 R95.1 R100.1 U7.2(GND) U8.2(GND) U9.69(EPAD) U10.13(GND) U10.18(GND) U10.24(GND) U10.37(GND) U10.43(GND) U10.48(GND) U10.49(SINK) U11.4(GND) U11.9(EP) Y2.2(GND) Y2.4(GND) Y3.2(GND)
VBUCK8_1V8: R70.1
VCC_1V05: R59.1
VCC_1V05_USB3: C43.1 C44.1 C58.2 C59.2 C60.2 C61.2 C62.2 R59.2 U9.3(VCCA10SSRX34) U9.9(VDD) U9.12(VCCA10SSRX34) U9.29(VDD) U9.45(VDD) U9.54(VCCA10SSRX12) U9.60(VDD) U9.63(VCCA10SSRX12)
VCC_3V3: C51.2 R58.1 U9.32(VSUS33) U9.46(VSUS33)
VCC_3V3_USB3: C52.2 C53.2 C70.2 C71.2 C72.2 C73.2 R58.2 R66.2 R67.2 R68.2 R71.1 R92.1 R96.1 R98.1 R99.1 U9.6(VCCA33SS34) U9.15(VCCA33SS34) U9.23(VCCA33PEX) U9.49(VCCA33SSM) U9.57(VCCA33SS12) U9.66(VCCA33SS12) U10.5(VCCOA1) U10.8(VCCOA2) U10.15(VCC1) U10.29(VCCOB1) U10.32(VCCOB2) U10.42(VCC2) U10.45(VCCOC) U11.7(~{HOLD(IO3)}) U11.8(VCC) Y3.4(VDD)
VCC_USB_5V_1: C39.1 C45.2 C46.2 J3.B1(VBUS) L5.2 R60.2
VCC_USB_5V_2: C41.1 C47.2 C48.2 J3.A1(VBUS) L6.2 R61.2
VIN: D6.1(A) D7.1(A)
CLK_OSC_100M: R68.1 R78.2 U10.20(CLKIN0) Y3.3(OUT)
MINI_PCIE_CLK_N: C67.1 ; port PCIE_CLK_N
MINI_PCIE_CLK_P: C65.1 ; port PCIE_CLK_P
PCIE_RX0_N: C56.1 ; port PCIE_RX0_N
PCIE_RX0_P: C55.1 ; port PCIE_RX0_P
PCIE_TX0_N: C57.1 ; port PCIE_TX0_N
PCIE_TX0_P: C63.1 ; port PCIE_TX0_P
PEXRST: C64.2 U9.19(PEXRST#) ; port PEXRST
PEXWAKE: R70.2 U9.20(PEXWAKE#) ; port PEXWAKE
PHY_PCIE_CLK_N: R72.1 R82.1 U9.22(PEXCLK_N)
PHY_PCIE_CLK_P: R69.1 R81.1 U9.21(PEXCLK_P)
PONRST: C54.1 R66.1 U9.31(PONRST)
SPICK: U9.35(SPICLK) U11.6(CLK)
SPICS: U9.34(SPICS) U11.1(~{CS})
SPISI: U9.36(SPIMOSI) U11.5(DI(IO0))
SPISO: U9.33(SPIMISO) U11.2(DO(IO1))
SSRX1_N: J3.B5(StdA_SSRX-) U9.56(USB_SSRXN_DN1)
SSRX1_P: J3.B6(StdA_SSRX+) U9.55(USB_SSRXP_DN1)
SSRX2_N: J3.A5(StdA_SSRX-) U9.65(USB_SSRXN_DN2)
SSRX2_P: J3.A6(StdA_SSRX+) U9.64(USB_SSRXP_DN2)
SSTX1_N: J3.B8(StdA_SSTX-) U9.53(USB_SSTXN_DN1)
SSTX1_P: J3.B9(StdA_SSTX+) U9.52(USB_SSTXP_DN1)
SSTX2_N: J3.A8(StdA_SSTX-) U9.62(USB_SSTXN_DN2)
SSTX2_P: J3.A9(StdA_SSTX+) U9.61(USB_SSTXP_DN2)
USBHP1_N: J3.B2(D-) U9.59(USB_DN_DN1)
USBHP1_P: J3.B3(D+) U9.58(USB_DP_DN1)
USBHP2_N: J3.A2(D-) U9.68(USB_DN_DN2)
USBHP2_P: J3.A3(D+) U9.67(USB_DP_DN2)
NetC39_2: C39.2 R60.1 R62.2 U7.3(FB)
NetC40_1: C40.1 D4.2(K) L5.1 U7.6(SW)
NetC40_2: C40.2 U7.1(BS)
NetC41_2: C41.2 R61.1 R63.2 U8.3(FB)
NetC42_1: C42.1 D5.2(K) L6.1 U8.6(SW)
NetC42_2: C42.2 U8.1(BS)
NetC49_2: C49.2 D6.2(K) R64.1 U7.5(IN)
NetC50_2: C50.2 D7.2(K) R65.1 U8.5(IN)
NetC55_2: C55.2 U9.28(PEXRX0_N)
NetC56_2: C56.2 U9.27(PEXRX0_P)
NetC57_2: C57.2 U9.25(PEXTX0_N)
NetC63_2: C63.2 U9.24(PEXTX0_P)
NetC65_2: C65.2 R74.1 R83.1
NetC66_2: C66.2 R67.1 R77.2 U10.21(CLKIN0*)
NetC67_2: C67.2 R76.1 R84.1
NetC68_2: C68.2 R97.2 U9.48(SSXO) Y2.3(XOUT)
NetC69_2: C69.2 R97.1 U9.47(SSXI) Y2.1(XIN)
NetR64_2: R64.2 U7.4(EN)
NetR65_2: R65.2 U8.4(EN)
NetR69_2: R69.2 U10.1(CLKOUTA0)
NetR71_2: R71.2 U9.18(SMI)
NetR72_2: R72.2 U10.2(CLKOUTA0*)
NetR73_1: R73.1 U10.41(CLKIN1)
NetR74_2: R74.2 U10.3(CLKOUTA1)
NetR75_1: R75.1 U10.40(CLKIN1*)
NetR76_2: R76.2 U10.4(CLKOUTA1*)
NetR79_2: R79.2 U10.6(CLKOUTA2)
NetR80_2: R80.2 U10.7(CLKOUTA2*)
NetR85_1: R85.1 U10.19(CLKIN_SEL0)
NetR86_2: R86.2 U10.9(CLKOUTA3)
NetR87_1: R87.1 U10.22(CLKIN_SEL1)
NetR88_2: R88.2 U10.10(CLKOUTA3*)
NetR89_2: R89.2 U10.11(CLKOUTA4)
NetR90_2: R90.2 U10.12(CLKOUTA4*)
NetR91_1: R91.1 U10.16(OSCIN)
NetR92_2: R92.2 U11.3(~{WP(IO2)})
NetR93_1: R93.1 U10.46(REFOUT_EN)
NetR94_2: R94.2 U9.50(SSREXT)
NetR95_2: R95.2 U10.14(CLKOUTA_TYPE0)
NetR96_2: R96.2 U10.47(CLKOUTA_TYPE1)
NetR98_2: R98.2 U10.23(CLKOUTB_TYPE0)
NetR99_2: R99.2 U10.39(CLKOUTB_TYPE1)
NetR100_2: R100.2 U10.38(NC/IREF)

Not connected (* = marked no-connect by the designer): J3 A7(GND_DRAIN) B7(GND_DRAIN); U9 1(USB_SSTXP_DN3) 2(USB_SSTXN_DN3) 4(USB_SSRXP_DN3) 5(USB_SSRXN_DN3) 7(USB_DP_DN3) 8(USB_DN_DN3) 10(USB_SSTXP_DN4) 11(USB_SSTXN_DN4) 13(USB_SSRXP_DN4) 14(USB_SSRXN_DN4) 16(USB_DP_DN4) 17(USB_DN_DN4) 26(RSRVD) 30(PEXCREQ#) 37(OVERCUR4#) 38(POWERON4#) 39(OVERCUR3#) 40(POWERON3#) 41(OVERCUR2#) 42(POWERON2#) 43(OVERCUR1#) 44(POWERON1#) 51(TESTEN); U10 17(OSCOUT) 25(CLKOUTB4*) 26(CLKOUTB4) 27(CLKOUTB3*) 28(CLKOUTB3) 30(CLKOUTB2*) 31(CLKOUTB2) 33(CLKOUTB1*) 34(CLKOUTB1) 35(CLKOUTB0*) 36(CLKOUTB0) 44(REFOUT); Y3 1(EN)

### Layout directives
differential pair: PHY_PCIE_CLK_N, PHY_PCIE_CLK_P, SSRX1_N, SSRX1_P, SSRX2_N, SSRX2_P, SSTX1_N, SSTX1_P, SSTX2_N, SSTX2_P, USBHP1_N, USBHP1_P, USBHP2_N, USBHP2_P

### Library data of the parts
C39-C73 = 电容-0402: Capacitor; Value: 0.1u
D4-D7 = 二极管-5B5817WS: 40V
J3 = 692141030100: USB 3.0 Type A, Receptacle, Horizontal, THR, Dual Stacked; Manufacturer: Wurth Elektronik; Rated Current: 1.8A; Pin Number: 18; Interface Type: Type A; Working Voltage: 30VAC; ComponentLink1Description: Manufacturer; ComponentLink1URL: http://www.we-online.de; ComponentLink2Description: Datasheet; ComponentLink2URL: https://katalog.we-online.com/em/datasheet/692141030100.pdf; Published Date: August 2020; Manufacturer Part Number: 692141030100; Gender: Receptacle; Type: Horizontal; Packaging: Tray; Operating Temperature: -40 to +85degC; Mounting Technology: THR; Application: USB 3.0
L5 L6 = 电感-201612
R58 R59 = 电阻-0603: Resistor; Value: 22R
R60-R100 = 电阻-0402: Resistor; Value: 22R
U7 U8 = ME3116: DC-DC
U9 = VL805: PCIE to USB3.0
Y2 = 晶振-4Pin-无源: as Y1 on sheet GE-PHY; Package: SMD-6 ECS International; Price: 0.75 USD; Availability: Unavailable; Value: *
Y3 = 晶振-4Pin-有源: 2520

## Nets that join several sheets
GND: Main (95 pins), GE-PHY (21 pins), PCIE-to-USB3 (68 pins)
VBUCK8_1V8: Main (7 pins), GE-PHY (R54.1), PCIE-to-USB3 (R70.1)
VCC_1V05: Main (5 pins), PCIE-to-USB3 (R59.1)
VCC_3V3: Main (20 pins), GE-PHY (5 pins), PCIE-to-USB3 (C51.2 R58.1 U9.32 U9.46)
VCC_USB_5V_2: Main (P1.27 P2.3 Q1.2), PCIE-to-USB3 (6 pins)
VIN: Main (C5.2 CON1.1 R4.2 U1.2), PCIE-to-USB3 (D6.1 D7.1)
GE_PHY_INT: Main (S1.102), GE-PHY (R54.2 U6.12)
GE_PHY_RST_N: Main (S1.26), GE-PHY (U6.16)
MDC: Main (S1.132), GE-PHY (U6.7)
MDIO: Main (R2.2 S1.134), GE-PHY (U6.8)
MINI_PCIE_CLK_N: Main (S1.92), PCIE-to-USB3 (C67.1)
MINI_PCIE_CLK_P: Main (S1.90), PCIE-to-USB3 (C65.1)
PCIE_RX0_N: Main (S1.59), PCIE-to-USB3 (C56.1)
PCIE_RX0_P: Main (S1.57), PCIE-to-USB3 (C55.1)
PCIE_TX0_N: Main (S1.68), PCIE-to-USB3 (C57.1)
PCIE_TX0_P: Main (S1.66), PCIE-to-USB3 (C63.1)
PEXRST: Main (S1.122), PCIE-to-USB3 (C64.2 U9.19)
PEXWAKE: Main (S1.46), PCIE-to-USB3 (R70.2 U9.20)
RGMII_RXD0: Main (S1.51), GE-PHY (R50.2)
RGMII_RXD1: Main (S1.49), GE-PHY (R51.2)
RGMII_RXD2: Main (S1.47), GE-PHY (R52.2)
RGMII_RXD3: Main (S1.45), GE-PHY (R53.2)
RGMII_RXD_CLK: Main (S1.43), GE-PHY (R48.2)
RGMII_RXD_EN: Main (S1.53), GE-PHY (R49.2)
RGMII_TXD0: Main (S1.103), GE-PHY (U6.50)
RGMII_TXD1: Main (S1.101), GE-PHY (U6.51)
RGMII_TXD2: Main (S1.99), GE-PHY (U6.54)
RGMII_TXD3: Main (S1.97), GE-PHY (U6.55)
RGMII_TXD_CLK: Main (S1.93), GE-PHY (U6.53)
RGMII_TXD_EN: Main (S1.105), GE-PHY (U6.56)